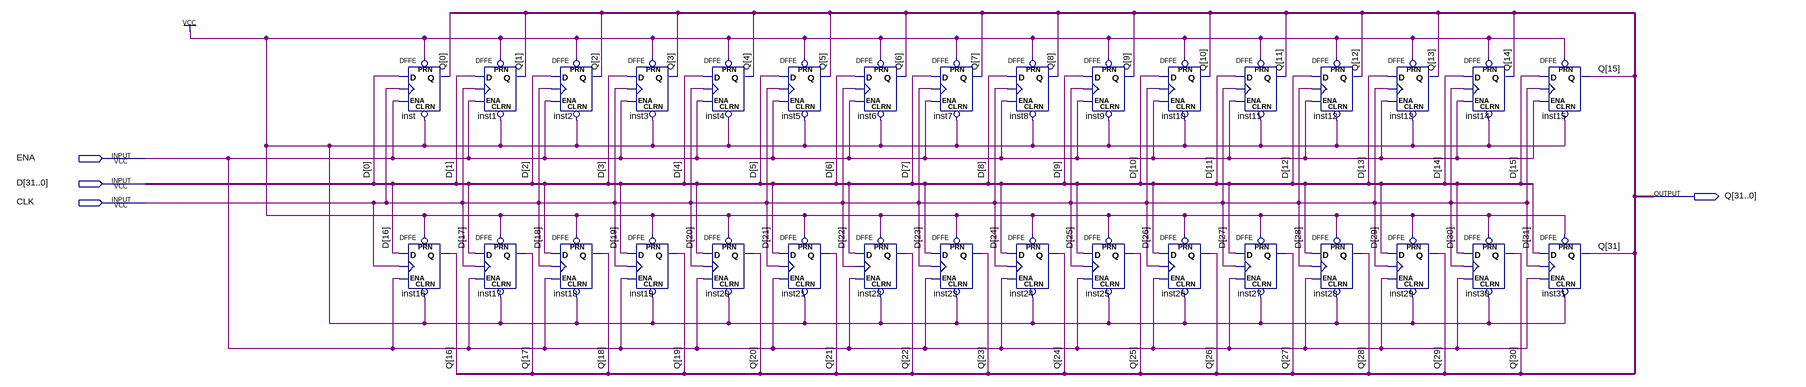
[diagram p0: schematic sheet]
// Quartus schematic BANCOdeREGISTRADORES32bits.bdf as structural Verilog: 32 symbols, 4 pins
module BANCOdeREGISTRADORES32bits (
  input  ENA,
  input  [31:0] D,
  input  CLK,
  output [31:0] Q
);

  DFFE inst (.PRN(1'b1), .CLRN(1'b1), .D(D[0]), .CLK(CLK), .ENA(ENA), .Q(Q[0]));
  DFFE inst16 (.PRN(1'b1), .CLRN(1'b1), .D(D[16]), .CLK(CLK), .ENA(ENA), .Q(Q[16]));
  DFFE inst1 (.PRN(1'b1), .CLRN(1'b1), .D(D[1]), .CLK(CLK), .ENA(ENA), .Q(Q[1]));
  DFFE inst17 (.PRN(1'b1), .CLRN(1'b1), .D(D[17]), .CLK(CLK), .ENA(ENA), .Q(Q[17]));
  DFFE inst2 (.PRN(1'b1), .CLRN(1'b1), .D(D[2]), .CLK(CLK), .ENA(ENA), .Q(Q[2]));
  DFFE inst18 (.PRN(1'b1), .CLRN(1'b1), .D(D[18]), .CLK(CLK), .ENA(ENA), .Q(Q[18]));
  DFFE inst3 (.PRN(1'b1), .CLRN(1'b1), .D(D[3]), .CLK(CLK), .ENA(ENA), .Q(Q[3]));
  DFFE inst19 (.PRN(1'b1), .CLRN(1'b1), .D(D[19]), .CLK(CLK), .ENA(ENA), .Q(Q[19]));
  DFFE inst4 (.PRN(1'b1), .CLRN(1'b1), .D(D[4]), .CLK(CLK), .ENA(ENA), .Q(Q[4]));
  DFFE inst20 (.PRN(1'b1), .CLRN(1'b1), .D(D[20]), .CLK(CLK), .ENA(ENA), .Q(Q[20]));
  DFFE inst5 (.PRN(1'b1), .CLRN(1'b1), .D(D[5]), .CLK(CLK), .ENA(ENA), .Q(Q[5]));
  DFFE inst21 (.PRN(1'b1), .CLRN(1'b1), .D(D[21]), .CLK(CLK), .ENA(ENA), .Q(Q[21]));
  DFFE inst6 (.PRN(1'b1), .CLRN(1'b1), .D(D[6]), .CLK(CLK), .ENA(ENA), .Q(Q[6]));
  DFFE inst22 (.PRN(1'b1), .CLRN(1'b1), .D(D[22]), .CLK(CLK), .ENA(ENA), .Q(Q[22]));
  DFFE inst7 (.PRN(1'b1), .CLRN(1'b1), .D(D[7]), .CLK(CLK), .ENA(ENA), .Q(Q[7]));
  DFFE inst23 (.PRN(1'b1), .CLRN(1'b1), .D(D[23]), .CLK(CLK), .ENA(ENA), .Q(Q[23]));
  DFFE inst8 (.PRN(1'b1), .CLRN(1'b1), .D(D[8]), .CLK(CLK), .ENA(ENA), .Q(Q[8]));
  DFFE inst24 (.PRN(1'b1), .CLRN(1'b1), .D(D[24]), .CLK(CLK), .ENA(ENA), .Q(Q[24]));
  DFFE inst9 (.PRN(1'b1), .CLRN(1'b1), .D(D[9]), .CLK(CLK), .ENA(ENA), .Q(Q[9]));
  DFFE inst25 (.PRN(1'b1), .CLRN(1'b1), .D(D[25]), .CLK(CLK), .ENA(ENA), .Q(Q[25]));
  DFFE inst10 (.PRN(1'b1), .CLRN(1'b1), .D(D[10]), .CLK(CLK), .ENA(ENA), .Q(Q[10]));
  DFFE inst26 (.PRN(1'b1), .CLRN(1'b1), .D(D[26]), .CLK(CLK), .ENA(ENA), .Q(Q[26]));
  DFFE inst11 (.PRN(1'b1), .CLRN(1'b1), .D(D[11]), .CLK(CLK), .ENA(ENA), .Q(Q[11]));
  DFFE inst27 (.PRN(1'b1), .CLRN(1'b1), .D(D[27]), .CLK(CLK), .ENA(ENA), .Q(Q[27]));
  DFFE inst12 (.PRN(1'b1), .CLRN(1'b1), .D(D[12]), .CLK(CLK), .ENA(ENA), .Q(Q[12]));
  DFFE inst28 (.PRN(1'b1), .CLRN(1'b1), .D(D[28]), .CLK(CLK), .ENA(ENA), .Q(Q[28]));
  DFFE inst13 (.PRN(1'b1), .CLRN(1'b1), .D(D[13]), .CLK(CLK), .ENA(ENA), .Q(Q[13]));
  DFFE inst29 (.PRN(1'b1), .CLRN(1'b1), .D(D[29]), .CLK(CLK), .ENA(ENA), .Q(Q[29]));
  DFFE inst14 (.PRN(1'b1), .CLRN(1'b1), .D(D[14]), .CLK(CLK), .ENA(ENA), .Q(Q[14]));
  DFFE inst30 (.PRN(1'b1), .CLRN(1'b1), .D(D[30]), .CLK(CLK), .ENA(ENA), .Q(Q[30]));
  DFFE inst15 (.PRN(1'b1), .CLRN(1'b1), .D(D[15]), .CLK(CLK), .ENA(ENA), .Q(Q[15]));
  DFFE inst31 (.PRN(1'b1), .CLRN(1'b1), .D(D[31]), .CLK(CLK), .ENA(ENA), .Q(Q[31]));
endmodule
